# EAGLE board Main 4000 Model (EAGLE 7.4.0)
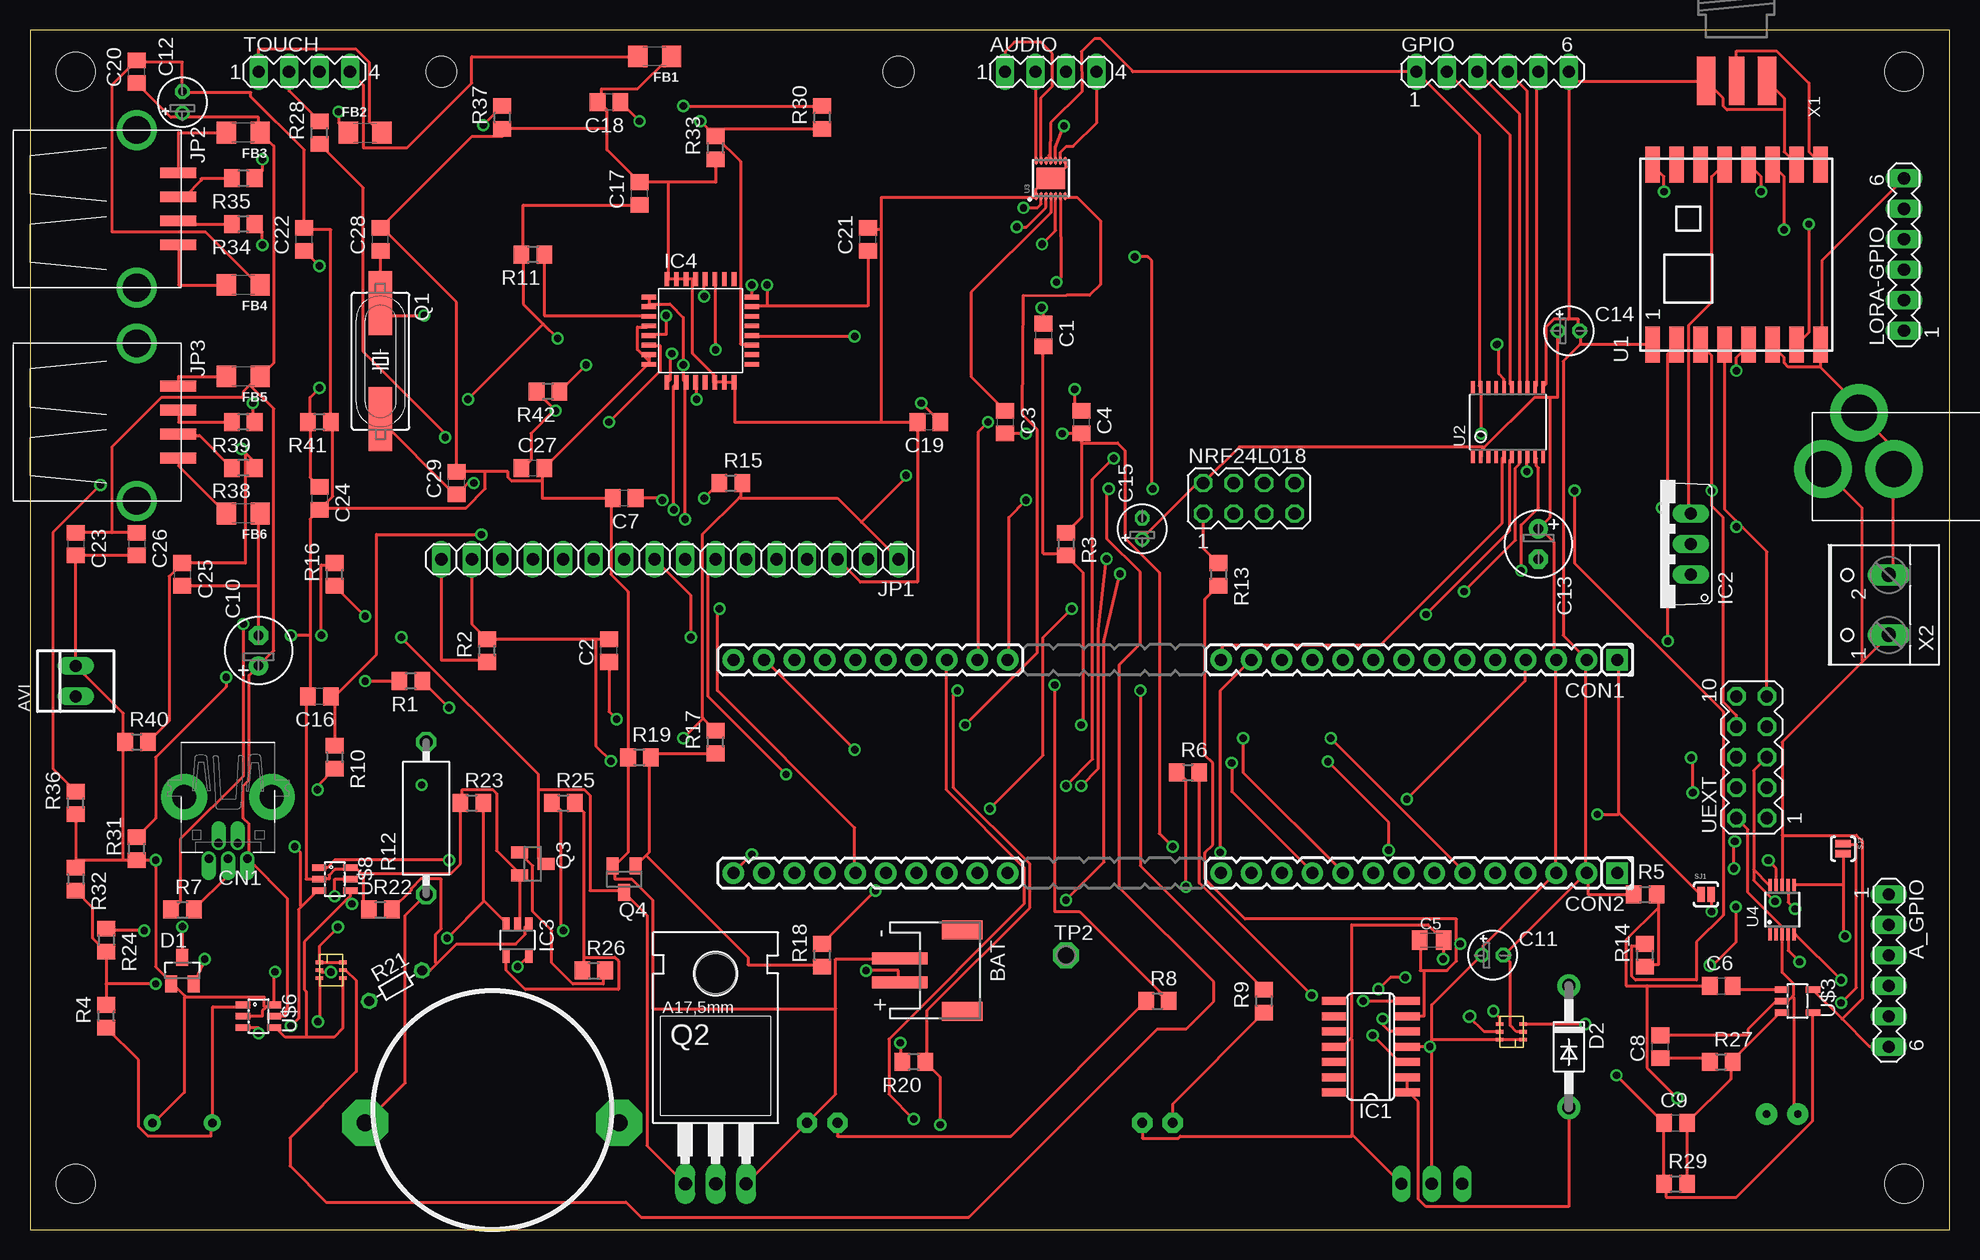
[diagram p4: board, top side]
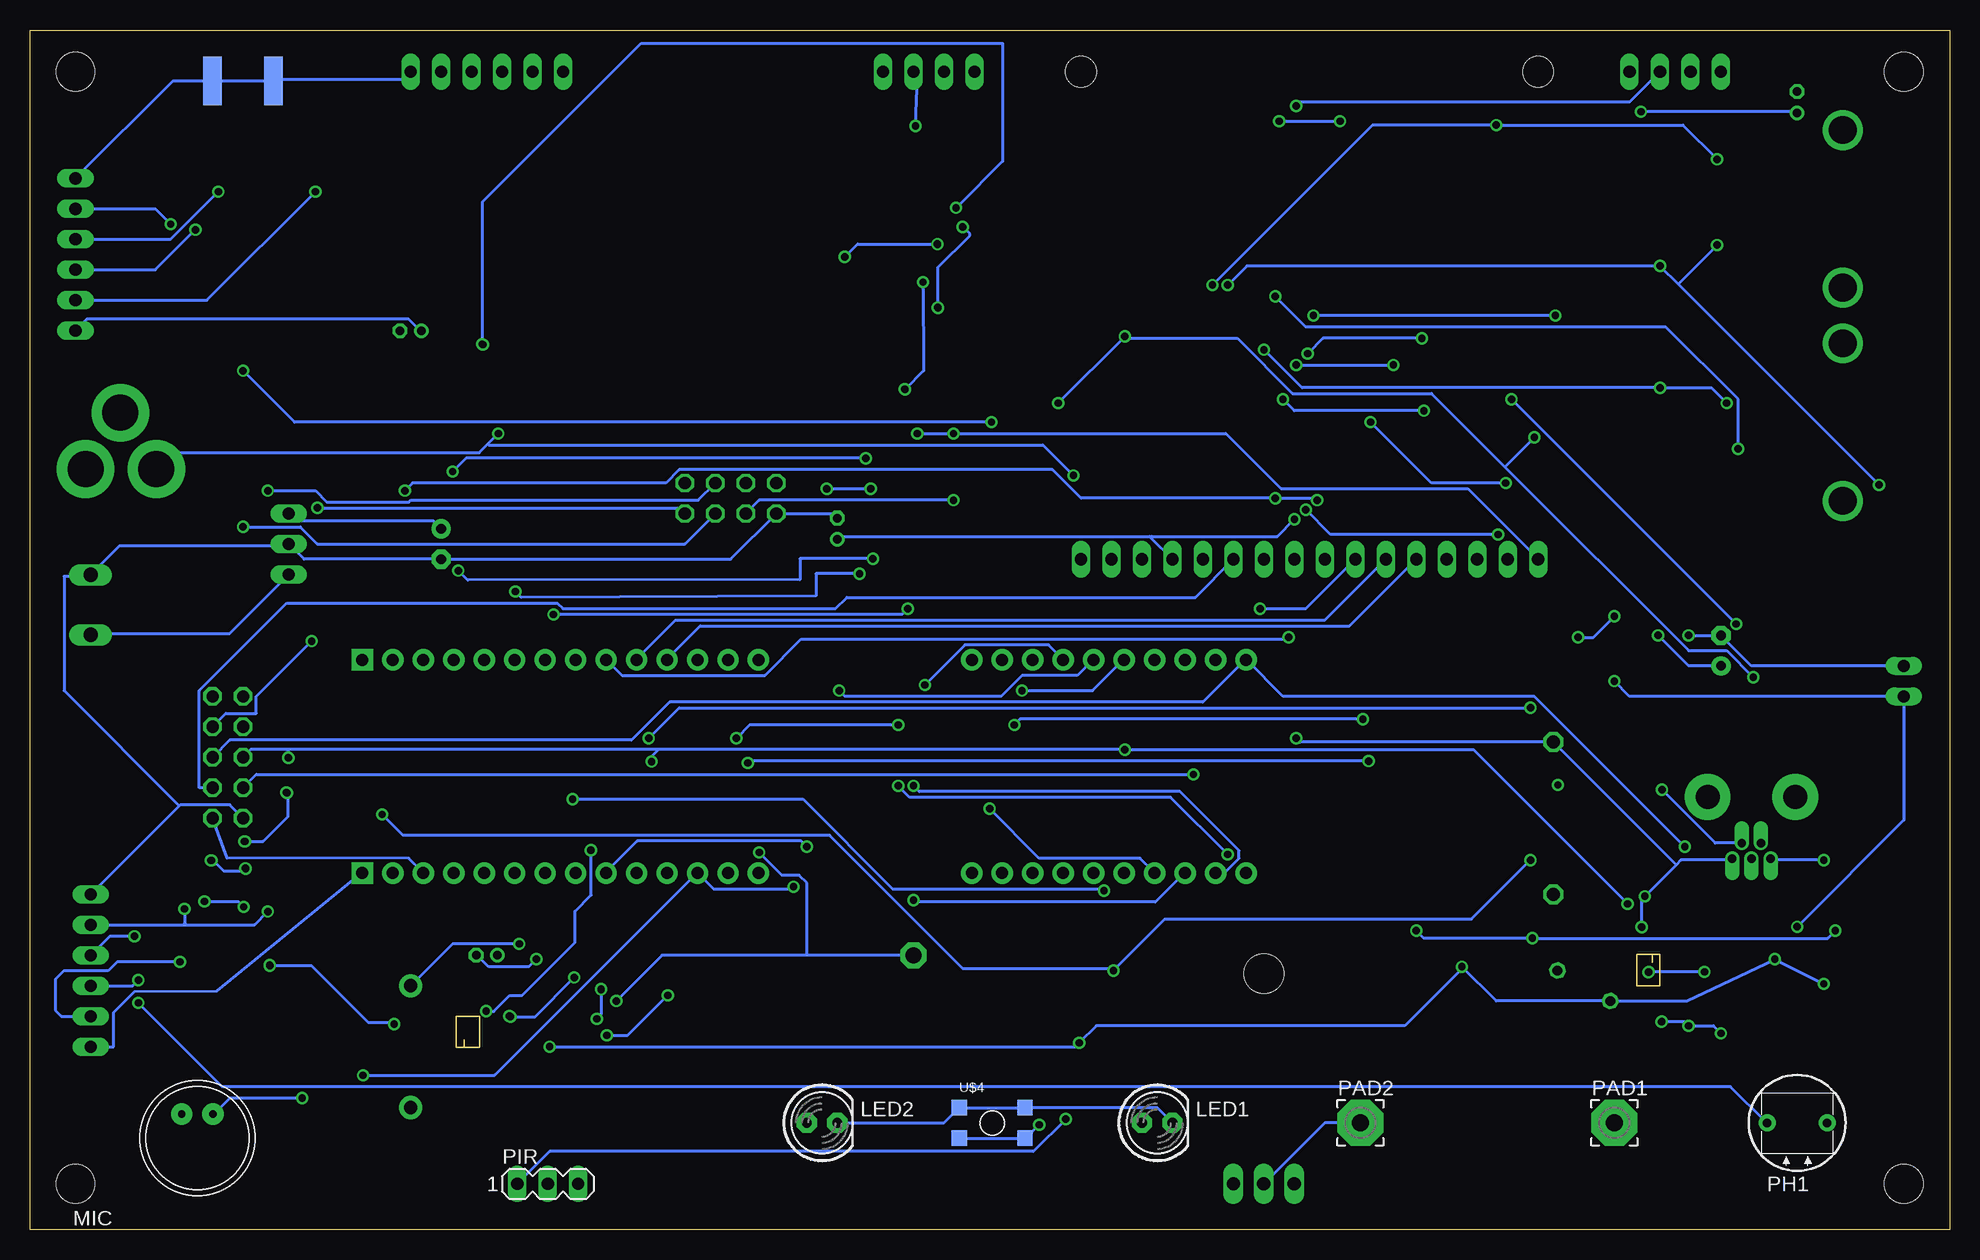
[diagram p5: board, bottom side, seen from below]

Size 160 x 100 mm. Coordinates in mm from the lower left corner, seen from the top.
Outline: 0,0 160,0 160,100 0,100 0,0
Copper layers (1*16): Top 0.035mm / dielectric 1.5mm / Bottom 0.035mm
Design rules "default": minimum track width 10mil, minimum drill 24mil, track to track 8mil, track to pad 8mil, pad to pad 8mil, via to via 8mil, smd to smd 8mil, copper to edge 40mil, drill to drill 8mil, minimum pad ring 10mil, minimum via ring 8mil, stop-mask expansion 4mil, vias tented up to drill 0mil, thermal gap 10mil
Holes 2.54 mm at 34.29,96.52 72.39,96.52
Holes 3.2 mm at 3.81,96.52 3.81,3.81 156.21,96.52 156.21,3.81

## Footprints (pad centres in the part's own frame; a part is rotated, then mirrored left to right if it is on the bottom)
MA06-1 = drill 1.016 long: 1 -6.35,0; 2 -3.81,0; 3 -1.27,0; 4 1.27,0; 5 3.81,0; 6 6.35,0
MA04-1 = drill 1.016 long: 1 -3.81,0; 2 -1.27,0; 3 1.27,0; 4 3.81,0
22-23-2021 = drill 1 long: 1 -1.27,0; 2 1.27,0
JST-PH-2-SMT-RA = smd 1 x 4.6: 1 1,-3.7; 2 -1,-3.7 | smd 1.6 x 3.4: NC1 -3.4,1.5; NC2 3.4,1.5
C0805 = smd 1.3 x 1.5: 1 -0.95,0; 2 0.95,0
C0805K = smd 1.3 x 1.6: 1 -1,0; 2 1,0
E2,5-6 = drill 0.813 pad 1.6: + -1.27,0 | drill 0.813 pad 1.6 octagon: - 1.27,0
E1,8-4 = drill 0.711 pad 1.168: + -0.889,0 | drill 0.711 pad 1.168 octagon: - 0.889,0
USB-MINIB-THM-MOLEX = drill 0.7 offset: D+ 0,9.72; D- -0.8,8.42; GND 1.6,9.72; ID 0.8,8.42; VBUS -1.6,9.72 | drill 2 pad 3.81: GND1 -3.65,4.57; GND4 3.65,4.57
HN1X30_WITHOUT(15-20) = drill 1 pad 1.778 square: 1 -36.83,0 | drill 1 pad 1.778: 2 -34.29,0; 3 -31.75,0; 4 -29.21,0; 5 -26.67,0; 6 -24.13,0; 7 -21.59,0; 8 -19.05,0; 9 -16.51,0; 10 -13.97,0; 11 -11.43,0; 12 -8.89,0; 13 -6.35,0; 14 -3.81,0; 21 13.97,0; 22 16.51,0; 23 19.05,0; 24 21.59,0; 25 24.13,0; 26 26.67,0; 27 29.21,0; 28 31.75,0; 29 34.29,0; 30 36.83,0
SOT23 = smd 1 x 1.4: 1 -0.95,-1.1; 2 0.95,-1.1; 3 0,1.1
DO41-10 = drill 1.118 pad 1.93: A 5.08,0; C -5.08,0
FB1206 = smd 1.6 x 1.8: 1 -1.4,0; 2 1.4,0
SO14 = smd 0.66 x 2.032: 1 -3.81,-3.073; 2 -2.54,-3.073; 3 -1.27,-3.073; 4 0,-3.073; 5 1.27,-3.073; 6 2.54,-3.073; 7 3.81,-3.073; 8 3.81,3.073; 9 2.54,3.073; 10 1.27,3.073; 11 0,3.073; 12 -1.27,3.073; 13 -2.54,3.073; 14 -3.81,3.073
TO220V = drill 1.016 long: 1 -2.54,-2.54; 2 0,-2.54; 3 2.54,-2.54
DBV-R-PDSO-G5 = smd 0.6 x 1.2: 1 -0.95,-1.306; 2 0,-1.306; 3 0.95,-1.306; 4 0.95,1.306; 5 -0.95,1.306
LQFP32 = smd 0.4 x 1.2: 1 -2.8,-4.3; 2 -2,-4.3; 3 -1.2,-4.3; 4 -0.4,-4.3; 5 0.4,-4.3; 6 1.2,-4.3; 7 2,-4.3; 8 2.8,-4.3; 17 2.8,4.3; 18 2,4.3; 19 1.2,4.3; 20 0.4,4.3; 21 -0.4,4.3; 22 -1.2,4.3; 23 -2,4.3; 24 -2.8,4.3 | smd 1.2 x 0.4: 9 4.3,-2.8; 10 4.3,-2; 11 4.3,-1.2; 12 4.3,-0.4; 13 4.3,0.4; 14 4.3,1.2; 15 4.3,2; 16 4.3,2.8; 25 -4.3,2.8; 26 -4.3,2; 27 -4.3,1.2; 28 -4.3,0.4; 29 -4.3,-0.4; 30 -4.3,-1.2; 31 -4.3,-2; 32 -4.3,-2.8
1X16 = drill 1.016 long: 1 -19.05,0; 2 -16.51,0; 3 -13.97,0; 4 -11.43,0; 5 -8.89,0; 6 -6.35,0; 7 -3.81,0; 8 -1.27,0; 9 1.27,0; 10 3.81,0; 11 6.35,0; 12 8.89,0; 13 11.43,0; 14 13.97,0; 15 16.51,0; 16 19.05,0
USB-A-S = smd 3 x 0.9: D+ 3.45,-1; D- 3.45,1; GND 3.45,-3; VBUS 3.45,3 | drill 2.311: P$5 0,-6.566; P$6 0,6.566
LED5MM = drill 0.813 pad 1.676 octagon: A -1.27,0; K 1.27,0
9.7ELECTRET = drill 0.6 pad 1.778: + 1.3,2; - -1.3,2
MA04-2 = drill 1.016 octagon: 1 -3.81,-1.27; 2 -3.81,1.27; 3 -1.27,-1.27; 4 -1.27,1.27; 5 1.27,-1.27; 6 1.27,1.27; 7 3.81,-1.27; 8 3.81,1.27
3,81/1,4 = drill 1.397 pad 3.81 octagon: 1 0,0
D11XX = drill 0.7 pad 1.4: 1 -2.5,0; 2 2.5,0
MA03-1 = drill 1.016 long: 1 -2.54,0; 2 0,0; 3 2.54,0
HC49UP = smd 5.334 x 1.93: 1 -4.826,0; 2 4.826,0
TO220AH = drill 1.118 long: B -2.54,-6.35; C 0,-6.35; E 2.54,-6.35 | hole 3.302: 0,11.176
R0805 = smd 1.3 x 1.5: 1 -0.95,0; 2 0.95,0
VMTB60 = drill 1.1 octagon: 1 -6.35,0; 2 6.35,0
R-5 = drill 0.813 octagon: 1 -2.54,0; 2 2.54,0
SJ_2S-NOTRACE = smd 0.635 x 1.27: 1 -0.401,0; 2 0.413,0
P1-13 = drill 1.321 pad 2.159 octagon: TP 0,0
RFM69HCW-XXXS2 = smd 3 x 1.2: 1 -7.5,7; 2 -7.5,5; 3 -7.5,3; 4 -7.5,1; 5 -7.5,-1; 6 -7.5,-3; 7 -7.5,-5; 8 -7.5,-7; 9 7.5,-7; 10 7.5,-5; 11 7.5,-3; 12 7.5,-1; 13 7.5,1; 14 7.5,3; 15 7.5,5; 16 7.5,7
TSSOP20 = smd 0.305 x 0.991: 1 -2.925,-2.918; 2 -2.275,-2.918; 3 -1.625,-2.918; 4 -0.975,-2.918; 5 -0.325,-2.918; 6 0.325,-2.918; 7 0.975,-2.918; 8 1.625,-2.918; 9 2.275,-2.918; 10 2.925,-2.918; 11 2.925,2.918; 12 2.275,2.918; 13 1.625,2.918; 14 0.975,2.918; 15 0.325,2.918; 16 -0.325,2.918; 17 -0.975,2.918; 18 -1.625,2.918; 19 -2.275,2.918; 20 -2.925,2.918
14-TDFN = smd 0.7 x 0.25: 1 -1.475,1.2; 2 -1.475,0.8; 3 -1.475,0.4; 4 -1.475,0; 5 -1.475,-0.4; 6 -1.475,-0.8; 7 -1.475,-1.2; 8 1.475,-1.2; 9 1.475,-0.8; 10 1.475,-0.4; 11 1.475,0; 12 1.475,0.4; 13 1.475,0.8; 14 1.475,1.2 | smd 1.78 x 2.35: 15 0,0
MSOP10 = smd 0.3 x 1: 1 -1,-2.05; 2 -0.5,-2.05; 3 0,-2.05; 4 0.5,-2.05; 5 1,-2.05; 6 1,2.05; 7 0.5,2.05; 8 0,2.05; 9 -0.5,2.05; 10 -1,2.05
SC-70 = smd 0.61 x 0.305: P$1 0,1.95; P$2 0,1.3; P$3 0,0.65; P$4 1.95,0.65; P$5 1.95,1.3; P$6 1.95,1.95
PJ-102A = drill 3 pad 4.8: RING 0.1,-3.39; RING_SW -4.6,-6.29; TIP 0.1,-9.29
SOT23-5L = smd 0.55 x 1.2: 1 -0.95,-1.3; 2 0,-1.3; 3 0.95,-1.3; 4 0.95,1.3; 5 -0.95,1.3
7914G = smd 1.27 x 1.27: 1 0,0; 2 0,5.486; 3 2.54,0; 4 2.54,5.486
SOT23-6 = smd 0.55 x 1.2: 1 -0.95,-1.3; 2 0,-1.3; 3 0.95,-1.3; 4 0.95,1.3; 5 0,1.3; 6 -0.95,1.3
MA05-2 = drill 1.016 octagon: 1 -5.08,-1.27; 2 -5.08,1.27; 3 -2.54,-1.27; 4 -2.54,1.27; 5 0,-1.27; 6 0,1.27; 7 2.54,-1.27; 8 2.54,1.27; 9 5.08,-1.27; 10 5.08,1.27
SMA_EDGELAUNCH = smd 4.064 x 1.524: GND@1 2.032,-2.54; GND@2 2.032,2.54 | smd 4.064 x 1.524 bottom: GND@3 2.032,2.54; GND@4 2.032,-2.54 | smd 4.064 x 1.27: P 2.032,0
W237-102 = drill 1.194 long: 1 -2.5,-1.27; 2 2.5,-1.27

## Placement (x,y rotation side)
A_GPIO  [MA06-1]  154.94,21.59 270 top
AUDIO  [MA04-1]  85.09,96.52 0 top
AVI  22-23-2021  [22-23-2021]  3.81,45.72 90 top
BAT  [JST-PH-2-SMT-RA]  76.2,21.59 270 top
C1  1uF  [C0805]  84.48,74.57 270 top
C2  1uF  [C0805]  48.26,48.26 90 top
C3  1uF  [C0805]  81.28,67.31 270 top
C4  1uF  [C0805]  87.63,67.31 270 top
C5  [C0805K]  116.84,24.13 0 top
C6  0.1uF  [C0805]  140.97,20.32 0 top
C7  0.1uF  [C0805]  49.53,60.96 180 top
C8  0.1uF  [C0805]  135.89,15.24 90 top
C9  100pf  [C0805]  137.16,8.89 0 top
C10  [E2,5-6]  19.05,48.26 90 top
C11  [E1,8-4]  121.92,22.86 0 top
C12  [E1,8-4]  12.7,93.98 90 top
C13  [E2,5-6]  125.73,57.15 270 top
C14  [E1,8-4]  128.27,74.93 0 top
C15  [E1,8-4]  92.71,58.42 90 top
C16  [C0805]  24.13,44.45 180 top
C17  [C0805]  50.8,86.36 90 top
C18  [C0805]  48.26,93.98 180 top
C19  [C0805]  74.93,67.31 180 top
C20  100uF  [C0805]  8.89,96.52 90 top
C21  [C0805]  69.85,82.55 90 top
C22  [C0805]  22.86,82.55 90 top
C23  100uF  [C0805]  3.81,57.15 270 top
C24  [C0805]  24.13,60.96 270 top
C25  [C0805]  12.7,54.61 270 top
C26  100uF  [C0805]  8.89,57.15 270 top
C27  2.2uF  [C0805]  41.91,63.5 0 top
C28  [C0805]  29.21,82.55 90 top
C29  [C0805]  35.56,62.23 90 top
CN1  [USB-MINIB-THM-MOLEX]  16.51,40.64 180 top
CON1  HN1X30_WITHOUT(15-20)  [HN1X30_WITHOUT(15-20)]  95.47,47.49 180 top
CON2  HN1X30_WITHOUT(15-20)  [HN1X30_WITHOUT(15-20)]  95.47,29.71 180 top
D1  BAT54S  [SOT23]  12.7,21.59 0 top
D2  1N4004  [DO41-10]  128.27,15.24 270 top
FB1  [FB1206]  52.07,97.79 180 top
FB2  [FB1206]  27.94,91.44 0 top
FB3  [FB1206]  17.78,91.44 180 top
FB4  [FB1206]  17.78,78.74 180 top
FB5  [FB1206]  17.78,71.12 180 top
FB6  [FB1206]  17.78,59.69 180 top
GPIO  [MA06-1]  121.92,96.52 0 top
IC1  QUAD_OPAMPD  [SO14]  111.76,15.24 90 top
IC2  7818TV  [TO220V]  135.89,57.15 90 top
IC3  TL331  [DBV-R-PDSO-G5]  40.64,24.13 180 top
IC4  TUSB2036  [LQFP32]  55.88,74.93 0 top
JP1  [1X16]  53.34,55.88 180 top
JP2  USB-A-S  [USB-A-S]  8.89,85.09 0 top
JP3  USB-A-S  [USB-A-S]  8.89,67.31 0 top
LED1  [LED5MM]  66.04,8.89 0 bottom
LED2  [LED5MM]  93.98,8.89 0 bottom
LORA-GPIO  [MA06-1]  156.21,81.28 90 top
MIC  [9.7ELECTRET]  146.05,7.62 0 bottom
NRF24L01  [MA04-2]  101.6,60.96 0 top
PAD1  [3,81/1,4]  27.94,8.89 0 bottom
PAD2  [3,81/1,4]  49.11,8.89 0 bottom
PH1  D1160_12  [D11XX]  12.7,8.89 0 bottom
PIR  [MA03-1]  116.84,3.81 0 bottom
Q1  16MHZ  [HC49UP]  29.21,72.39 270 top
Q2  TIP120  [TO220AH]  57.15,10.16 0 top
Q3  BC846  [SOT23]  41.91,30.48 270 top
Q4  BC846  [SOT23]  49.53,29.21 180 top
R1  0R  [R0805]  31.75,45.72 180 top
R2  120R  [R0805]  38.1,48.26 90 top
R3  120R  [R0805]  86.36,57.15 270 top
R4  [R0805]  6.35,17.78 90 top
R5  1M  [R0805]  134.62,27.94 0 top
R6  [R0805]  96.52,38.1 0 top
R7  [R0805]  12.7,26.67 0 top
R8  [R0805]  93.98,19.05 0 top
R9  [R0805]  102.87,19.05 90 top
R10  [R0805]  25.4,39.37 270 top
R11  1.5k  [R0805]  41.91,81.28 180 top
R12  1.8R 1.8W  [VMTB60]  33.02,34.29 90 top
R13  [R0805]  99.06,54.61 270 top
R14  2k  [R0805]  134.62,22.86 90 top
R15  2k  [R0805]  58.42,62.23 0 top
R16  3.2k  [R0805]  25.4,54.61 90 top
R17  33.2k  [R0805]  57.15,40.64 90 top
R18  2.21k  [R0805]  66.04,22.86 90 top
R19  dnp  [R0805]  50.8,39.37 0 top
R20  [R0805]  73.66,13.97 180 top
R21  THERMISTOR-5  [R-5]  30.48,20.32 30 top
R22  4.75k  [R0805]  29.21,26.67 0 top
R23  4.75k  [R0805]  36.83,35.56 0 top
R24  4.75k  [R0805]  6.35,24.13 270 top
R25  332k  [R0805]  44.45,35.56 0 top
R26  2.21k  [R0805]  46.99,21.59 0 top
R27  10k  [R0805]  140.97,13.97 0 top
R28  [R0805]  24.13,91.44 90 top
R29  100k  [R0805]  137.16,3.81 0 top
R30  [R0805]  66.04,92.71 90 top
R31  15k  [R0805]  8.89,31.75 90 top
R32  10K  [R0805]  3.81,29.21 270 top
R33  15k  [R0805]  57.15,90.17 90 top
R34  [R0805]  17.78,83.82 180 top
R35  [R0805]  17.78,87.63 180 top
R36  15k  [R0805]  3.81,35.56 90 top
R37  15k  [R0805]  39.37,92.71 90 top
R38  [R0805]  17.78,63.5 180 top
R39  [R0805]  17.78,67.31 180 top
R40  15k  [R0805]  8.89,40.64 0 top
R41  15k  [R0805]  24.13,67.31 180 top
R42  100k  [R0805]  43.18,69.85 180 top
SJ1  SOLDERJUMPER-OLDNC2  [SJ_2S-NOTRACE]  139.7,27.94 0 top
SJ2  SOLDERJUMPER-OLDNC2  [SJ_2S-NOTRACE]  151.13,31.75 270 top
TOUCH  [MA04-1]  22.86,96.52 0 top
TP2  PTR1PAD1-13  [P1-13]  86.36,22.86 0 top
U1  RFM69HCW  [RFM69HCW-XXXS2]  142.24,81.28 90 top
U2  [TSSOP20]  123.19,67.31 0 top
U3  MAX98306ETD+  [14-TDFN]  85.09,87.63 90 top
U4  ADS1015  [MSOP10]  146.05,26.67 0 top
U$1  TPL0401A/B  [SC-70]  24.13,20.32 0 top
U$2  2.1MMJACKTHM  [PJ-102A]  158.75,63.5 270 top
U$3  MAX4466  [SOT23-5L]  147.32,19.05 270 top
U$4  TACTILE-SWITCH-7914G  [7914G]  82.55,10.16 270 bottom
U$5  TPL0401A/B  [SC-70]  124.46,17.78 180 top
U$6  MCP3425SOT  [SOT23-6]  19.05,17.78 270 top
U$8  MCP3425SOT  [SOT23-6]  25.4,29.21 270 top
UEXT  [MA05-2]  143.51,39.37 90 top
X1  [SMA_EDGELAUNCH]  142.24,97.79 270 top
X2  [W237-102]  153.67,52.07 90 top

## Tracks (layer width: path | path; a pad name or v marks a point on that pad's centre or on a via)
3.3V  (via drill 0.61)
  Top 0.254: R24.2 6.35,20.48 | 6.35,20.48 R4.2 | R24.2 5.24,24.29 5.24,26.83 R32.2 | R24.2 | v40.64,21.91 41.43,22.7 IC3.5 | v14.57,22.54 13.65,20.48 D1.2 | v72.55,15.56 72.55,14.13 R20.2 | v10.48,20.48 6.35,20.48 | 51.59,77.15 51.59,77.63 IC4.25 | 51.59,77.15 51.59,76.99 IC4.26 | 51.59,77.15 53.34,77.15 54.45,76.04 v54.45,72.07 54.45,70.8 54.61,70.64 IC4.3 54.61,70.48 v54.61,59.21 | v46.35,72.07 R42.1 | C15.+ 92.71,57.63 97.31,62.23 NRF24L01.2 100.81,65.25 121.13,65.25 121.21,65.17 | 116.84,15.24 v116.68,15.24 IC1.4 | PIR.2 116.84,15.24 | 116.84,15.24 116.84,15.83 | 116.84,15.83 116.84,18.73 120.97,22.86 C11.+ 121.13,22.86 121.13,23.65 127.16,29.69 CON2.3 127.16,29.84 127.16,47.47 CON1.3 127.16,47.62 127,47.78 127,57.31 125.89,58.42 C13.+ 126.68,59.37 126.68,69.37 | IC2.3 138.27,59.85 138.27,75.41 140.18,77.31 140.18,87.79 141.13,88.74 U1.13 | 121.21,65.17 125.41,69.37 126.68,69.37 | 121.21,65.17 120.97,64.93 120.97,64.45 U2.2 | 126.68,69.37 127.32,69.37 127.32,74.93 C14.+ | 116.84,15.83 U$5.P$6 U$5.P$1
  Bottom 0.254: v10.48,20.48 v14.57,22.54 21.91,19.05 R21.1 37.78,19.05 v40.64,21.91 40.64,21.75 45.4,16.99 71.12,16.99 v72.55,15.56 72.87,15.24 v116.68,15.24 | v54.45,72.07 v46.35,72.07 | 66.6,57.71 66.67,57.78 92.55,57.78 92.71,57.63 C15.+ | 66.6,57.71 JP1.4 | v54.61,59.21 56.04,57.78 66.52,57.78 66.6,57.71 | UEXT.1 143.57,30.96 128.43,30.96 127.32,29.84 CON2.3 | LORA-GPIO.1 155.26,75.88 128.43,75.88 127.48,74.93 C14.+ | IC2.3 137.79,59.05 126.36,59.05 C13.+
5V  (via drill 0.6, 0.61)
  Top 0.254: 12.7,92.71 11.75,92.71 C20.1 | 12.7,92.71 C12.+ 12.7,93.03 | v25.72,93.19 25.72,92.23 26.51,91.44 FB2.1 | 6.83,58.1 C26.1 | 6.83,58.1 C23.1 | FB5.1 19.21,71.12 20.32,72.23 20.32,90.33 19.21,91.44 FB3.1 19.05,91.44 19.05,92.71 12.7,92.71 | 6.83,58.1 6.83,65.25 10.95,69.37 17.78,69.37 17.78,69.85 19.05,71.12 FB5.1 | 56.12,42.62 56.04,42.7 56.04,57.94 59.13,61.04 | 56.12,42.62 R17.2 | 59.13,61.04 59.21,61.12 59.21,62.23 R15.2 | 69.29,58.98 67.31,60.96 59.21,60.96 59.13,61.04 | 69.29,58.98 JP1.1 | v24.29,49.53 24.29,55.4 25.4,55.4 R16.2 | U$6.5 21.27,17.78 21.27,18.26 21.43,18.41 21.43,27.62 18.26,30.8 CN1.VBUS 18.26,30.96 18.26,33.81 17.78,34.29 17.78,36.99 18.26,37.47 18.26,46.2 C10.+ 20.32,48.26 20.32,68.42 18.41,70.33 FB5.1 | U$8.5 25.4,29.21 v25.4,27.78 | v54.45,40.96 56.12,42.62 | 84.93,89.53 84.93,89.38 84.77,89.22 U3.12 U3.11 85.03,89.16 85.08,92.26 87.69,94.86 87.64,98.19 88.74,99.29 89.21,99.29 91.92,96.59 91.92,96.52 GPIO.1 120.81,91.28 120.81,70.33 U2.19 120.97,70.17 v120.97,66.36 | 151.05,17.54 153.35,15.24 A_GPIO.6 | 151.05,17.54 148.75,19.84 U$3.5 | 146.05,32.86 146.05,40.64 152.8,47.39 | 146.05,32.86 U4.8 | 152.8,47.39 154.94,49.53 X2.1 | U$2.TIP 149.54,63.34 152.72,60.17 152.72,47.47 152.8,47.39 | 151.05,17.54 152.72,19.21 152.72,32.38 152.24,32.86 146.05,32.86 | 69.29,58.98 73.03,62.71 v73.03,62.87 | U$1.P$6 U$1.P$1 24.13,23.64 25.52,25.04 25.52,25.07 v25.65,25.2
  Bottom 0.254: v25.72,93.19 12.7,93.19 C12.+ | v24.29,49.53 21.75,46.99 C10.+ | 22.78,30.4 22.38,30.8 18.26,30.8 CN1.VBUS | 22.78,30.4 v25.4,27.78 25.65,27.53 v25.65,25.2 | 22.78,30.4 R12.2 54.13,40.64 v54.45,40.96 | A_GPIO.6 153.03,15.24 153.03,18.1 151.29,19.84 144.4,19.88 132.4,29.69 CON2.1 | IC2.1 143.35,49.69 154.94,49.69 X2.1 | 121.84,65.48 122.56,64.77 148.11,64.77 149.38,63.5 U$2.TIP | 121.84,65.48 v120.97,66.36 | v73.03,62.87 75.56,65.41 121.76,65.41 121.84,65.48
AMP
  Top 0.254: U2.5 122.71,64.29 122.71,58.9 112.55,48.74 99.38,48.74 99.38,47.62 CON1.14
AMP_PWR  (via drill 0.6)
  Top 0.254: U2.16 122.86,70.89 122.42,71.34 122.42,73.59 v122.25,73.76 | v82.8,85.17 83.97,85.17 84.29,85.49 U3.2
  Bottom 0.254: v122.25,73.76 122.25,85.7 109.06,98.9 78.92,98.9 78.92,89.05 82.66,85.31 | 82.66,85.31 | 82.66,85.31 v82.8,85.17
AUDIO_GND  (via drill 0.61)
  Top 0.254: JP1.16 34.29,47.47 38.1,47.47 R2.1 | C4.2 87.63,65.56 | 87.63,65.56 87.63,59.37 R3.1 | v83.03,66.36 C3.2 | C4.2 v86.04,66.36 | C4.2 | v95.25,31.91 94.14,33.02 94.14,54.77 91.28,57.63 91.28,64.93 90.65,65.56 87.63,65.56
  Bottom 0.254: v86.04,66.36 v83.03,66.36 60.33,66.36 55.72,61.75 40.16,61.75 JP1.16 | v95.25,31.91 95.73,32.38 109.38,32.38 111.92,29.84 CON2.9
AUDIO_L  (via drill 0.61)
  Top 0.254: v101.12,40.96 101.12,38.1 109.38,29.84 CON2.10 | v87.63,42.07 87.79,42.23 87.79,54.77 R3.2 86.36,56.36 84.45,56.36 84.45,73.11 C1.2
  Bottom 0.254: v101.12,40.96 100.01,42.07 v87.63,42.07
AUDIO_R  (via drill 0.61)
  Top 0.254: R2.2 36.83,50.48 JP1.15 | R2.2 47.15,49.21 | 47.15,49.21 C2.2 | R2.2 | v100.17,38.89 100.17,36.51 106.84,29.84 CON2.11 | v48.42,39.05 47.15,40.32 47.15,49.21
  Bottom 0.254: v100.17,38.89 100.01,39.05 v48.42,39.05
DM1  (via drill 0.61)
  Top 0.254: R33.2 59.21,89.06 59.21,73.82 60.17,73.82 IC4.11 | v50.8,92.39 C18.1 | R33.2 v55.88,92.39 | R33.2 56.67,91.76 R30.1
  Bottom 0.254: v55.88,92.39 v50.8,92.39
DM2  (via drill 0.61)
  Top 0.254: 61.44,76.99 69.85,76.99 C21.1 | 61.44,76.99 60.33,76.99 IC4.15 | v19.37,89.22 19.37,88.27 R35.1 | v37.78,92.08 R37.2 | v61.44,78.74 61.44,76.99
  Bottom 0.254: v19.37,89.22 22.23,92.08 v37.78,92.08 48.1,92.08 v61.44,78.74
DM3  (via drill 0.61)
  Top 0.254: v57.15,73.34 57.15,79.22 IC4.19 | v24.13,70.17 23.34,69.37 23.34,67.31 | 23.34,67.31 23.34,62.71 C24.1 | 23.34,67.31 R41.2 | v18.57,68.9 18.57,67.31 R39.1
  Bottom 0.254: v57.15,73.34 53.98,70.17 v24.13,70.17 19.84,70.17 v18.57,68.9
DP1  (via drill 0.61)
  Top 0.254: v68.74,74.45 60.33,74.45 IC4.12 | v74.3,68.9 75.72,67.47 75.72,67.31 C19.1 | v16.35,46.04 16.35,45.24 10.48,39.37 10.48,34.29 R31.2 | v34.61,66.04 34.61,66.36 27.78,73.18 27.78,86.84 R28.1
  Bottom 0.254: v74.3,68.9 v68.74,74.45 68.74,74.3 59.37,74.3 54.77,69.69 43.18,69.69 37.07,63.58 | v16.35,46.04 18.57,48.26 21.75,48.26 37.07,63.58 | 37.07,63.58 v34.61,66.04
DP2  (via drill 0.61)
  Top 0.254: v60.17,78.74 60.17,77.79 IC4.16 | v24.13,80.33 C22.1 | v5.87,62.07 1.91,58.1 1.91,38.42 R36.2 | v19.37,82.07 19.37,83.19 R34.1
  Bottom 0.254: v60.17,78.74 58.58,80.33 v24.13,80.33 22.62,78.82 | 22.62,78.82 v5.87,62.07 | 22.62,78.82 v19.37,82.07
DP3  (via drill 0.61)
  Top 0.254: C25.1 11.59,54.45 11.59,42.39 R40.2 | v56.2,77.79 56.2,79.22 IC4.20 | 18.02,64.69 18.57,64.14 18.57,63.5 R38.1 | 18.02,64.69 v17.62,65.09 | C25.1 17.94,55.56 17.94,64.61 18.02,64.69 | C25.1
  Bottom 0.254: v56.2,77.79 53.66,75.25 23.65,75.25 17.62,69.22 v17.62,65.09
GND  (via drill 0.6, 0.61)
  Top 0.254: R5.1 129.86,27.94 129.86,29.69 CON2.2 | CON2.2 129.7,29.69 122.87,22.86 C11.- 123.39,22.28 123.39,17.01 123.92,16.48 U$5.P$2 | CON2.2 129.7,29.84 129.7,47.47 CON1.2 129.7,47.62 127.79,49.53 127.79,72.39 129.22,73.82 | 146.21,93.34 146.21,94.3 144.78,95.73 X1.GND@3 | 146.21,93.34 146.21,89.85 147.16,88.9 U1.10 | 139.7,95.73 141.13,94.3 141.13,93.66 141.45,93.34 146.21,93.34 | 128.27,75.88 129.06,75.88 129.06,74.93 C14.- 129.22,74.93 129.22,73.82 | 128.27,75.88 127,75.88 126.36,75.25 126.36,70.48 126.21,70.33 U2.11 | 129.22,73.82 135.1,73.82 U1.1 | 128.27,95.73 128.27,75.88 | 128.27,95.73 139.7,95.73 | 139.7,95.73 X1.GND@4 | 128.27,95.73 GPIO.6 | 146.92,19.45 146.53,19.05 U$3.2 145.57,19.05 143.19,16.67 143.19,16.19 C8.2 | 146.92,19.45 147,19.53 147,20.48 146.05,21.43 U4.3 146.05,25.24 143.19,28.1 143.19,33.34 UEXT.2 | MIC.- 147.32,9.68 147,10 147,19.37 146.92,19.45 | 149.22,71.91 146.53,71.91 146.21,72.23 146.21,72.71 145.26,73.66 U1.6 | 149.22,71.91 149.22,73.66 U1.8 149.38,73.82 149.38,80.8 LORA-GPIO.6 | 149.22,71.91 152.4,68.74 152.4,68.1 U$2.RING_SW 152.56,67.94 155.26,65.25 155.26,63.5 U$2.RING 155.26,63.34 155.26,54.93 154.94,54.61 X2.2 | NRF24L01.1 97.79,56.83 R13.1 | R37.1 39.37,91.12 36.83,91.12 C28.2 29.37,83.5 35.56,77.31 C29.2 | 55.24,79.22 55.4,79.22 IC4.21 | 55.24,79.22 54.77,79.22 IC4.22 54.61,79.22 53.98,79.22 IC4.23 53.82,79.22 53.18,79.22 IC4.24 53.18,79.38 53.18,87.31 | 53.18,87.31 57.15,87.31 R33.1 | 53.18,87.31 C17.2 | 48.1,91.76 48.1,90.01 C17.2 | 48.1,91.76 48.1,93.34 47.47,93.98 C18.2 47.62,93.98 47.62,95.09 50.64,95.09 53.34,97.79 FB1.1
  Top 0.254: C17.2 | 48.1,91.76 R37.1 | R37.1 | U3.8 86.36,89.06 86.36,88.58 85.41,87.63 U3.15 84.77,87.63 83.82,86.68 83.82,86.2 U3.1 83.82,86.04 70.96,86.04 70.96,83.34 | 70.96,67.31 58.74,67.31 58.74,70.48 IC4.8 58.58,70.64 57.94,70.64 IC4.7 57.78,70.64 57.15,70.64 IC4.6 56.99,70.64 56.99,71.28 55.24,73.03 55.24,79.22 | 70.96,67.31 C19.2 | 70.96,83.34 69.85,83.34 C21.2 | 70.96,67.31 70.96,83.34 | JP1.3 69.22,53.98 73.98,53.98 C19.2 | C19.2 | 117.79,24.13 116.52,25.4 110.17,25.4 110.17,16.03 110.09,15.95 | 110.09,15.95 109.38,15.24 IC1.11 | 110.25,7.86 110.17,7.94 110.17,15.88 110.09,15.95 | 110.25,7.86 PIR.3 | Q2.E LED1.K 67.15,11.27 67.15,18.41 | 67.15,18.41 67.15,22.54 72.39,22.54 BAT.2 | LED2.K 92.71,7.62 95.73,7.62 95.89,7.78 110.17,7.78 110.25,7.86 | U$6.2 19.37,17.78 19.37,18.26 19.61,18.49 | 19.61,18.49 19.68,18.57 20.32,18.57 U$6.6 20.35,21.32 20.46,21.43 20.46,21.45 v20.42,21.48 | 12.94,19.45 13.02,19.37 19.53,19.37 19.53,18.57 19.61,18.49 | 12.94,19.45 11.91,20.48 D1.1 11.75,20.64 10.48,21.91 v10.48,30.8 R31.1 | PH1.2 10.32,8.89 12.86,11.43 12.86,19.37 12.94,19.45 | 19.05,53.66 C25.2 | C10.- 19.05,53.66 | 19.05,53.66 19.05,59.69 FB6.1 | C23.2 C26.2 | R36.1 3.81,30.8 | 3.81,30.8 7.78,30.8 | 7.78,30.8 R31.1 | 3.81,30.8 R32.1 | 7.78,30.8 7.78,40.48 R40.1 7.78,40.64 7.78,43.02 AVI.2 C23.2 | R31.1 | C23.2 | R19.1 49.85,31.43 48.74,30.32 Q4.2 48.74,30.16 48.74,29.21 50.16,29.21 51.91,27.46 51.91,18.41 67.15,18.41 | 51.59,72.39 51.59,72.87 IC4.31 | 51.59,72.39 51.59,72.23 IC4.32 51.44,72.07 C27.2 42.7,63.5 42.7,62.39 | 51.59,72.39 50.64,73.34 50.64,75.25 51.44,75.25 IC4.28 | 37.94,63.18 39.85,63.18 39.85,62.71 40.16,62.39 42.7,62.39
  Top 0.254: 37.94,63.18 C29.2 | 48.42,60.96 42.7,60.96 42.7,62.39 | 48.42,60.96 C7.2 | R19.1 49.85,53.18 48.42,54.61 48.42,60.96 | R19.1 | FB4.1 19.05,78.74 14.61,83.19 6.83,83.19 6.83,95.41 C20.2 8.89,97.31 12.7,97.31 C12.- 12.7,94.77 18.41,94.77 18.41,94.46 22.86,90.01 C22.2 22.86,83.34 25.08,83.34 R41.1 | IC3.2 40.64,25.56 40.8,25.72 40.8,29.53 Q3.2 40.8,29.69 38.89,31.59 38.89,36.35 38.58,36.67 36.04,36.67 36.04,35.56 R23.1 35.88,30.48 35.08,29.69 27.78,29.69 27.7,29.61 | 27.7,29.61 27.3,30 26.83,30 U$8.6 26.67,30 25.4,30 24.92,29.53 24.92,29.21 U$8.2 23.02,29.21 23.02,44.29 C16.2 23.34,44.45 23.34,49.53 | 27.7,29.61 27.78,29.53 27.78,27.15 R22.1 | 23.34,49.53 23.34,59.21 C24.2 | R41.1 25.24,67.15 25.24,61.12 C24.2 | C24.2 24.45,60.17 36.35,60.17 37.94,61.75 37.94,63.18 | R41.1 | 23.34,49.53 v21.75,49.53 | C29.2 | 117.79,24.13 v117.79,22.54 | 117.79,24.13 C5.2 | v25.09,21.43 24.32,21.43 U$1.P$2
  Bottom 0.254: LORA-GPIO.6 148.11,95.73 144.78,95.73 | GPIO.6 128.91,95.89 139.7,95.89 X1.GND@4 139.7,95.73 144.78,95.73 | 144.78,95.73 X1.GND@3 | 147.56,35.32 147.48,35.4 143.35,35.4 UEXT.2 | 147.56,35.32 A_GPIO.1 | C15.- 92.71,59.37 93.03,59.69 NRF24L01.1 101.6,55.88 C13.- 137.16,55.88 IC2.2 138.43,56.99 152.56,56.99 154.94,54.61 X2.2 154.94,54.45 157.16,54.45 157.16,44.93 147.56,35.32 | LED2.K 83.82,8.89 U$4.1 U$4.2 66.04,10.16 LED1.K | v10.48,30.8 14.76,30.8 CN1.GND | AVI.2 16.51,46.99 C10.- v21.75,49.53 | v117.79,22.54 118.43,21.91 121.76,21.91 122.71,22.86 C11.- | v20.42,21.48 25.04,21.48 v25.09,21.43
H_LED  (via drill 0.61)
  Top 0.254: v70.48,28.26 R18.2 | v114.78,35.88 124.62,45.72 124.62,47.47 CON1.4
  Bottom 0.254: v70.48,28.26 70.64,28.42 88.11,28.42 95.57,35.88 v114.78,35.88
LORA_CS  (via drill 0.61)
  Top 0.254: v142.24,71.6 142.24,72.71 143.19,73.66 U1.5 | v79.85,67.31 79.06,66.52 79.06,47.62 CON1.22
  Bottom 0.254: v142.24,71.6 137.95,67.31 v79.85,67.31
MIC  (via drill 0.61)
  Top 0.254: v96.36,28.57 96.36,37.47 95.73,38.1 R6.1 | U$3.4 148.59,18.1 148.59,9.05 142.24,2.7 136.37,2.7 136.37,3.81 R29.1 C9.1 | C9.1 v132.24,12.86 | C9.1
  Bottom 0.254: v96.36,28.57 96.52,28.42 103.03,28.42 104.3,29.69 CON2.12 104.46,29.69 121.28,12.86 v132.24,12.86
MISO  (via drill 0.61)
  Top 0.254: v136.53,49.05 136.53,60.17 | 136.53,60.17 136.53,73.03 137.16,73.66 U1.2 | 136.53,60.17 v136.05,60.17
  Bottom 0.254: v136.53,49.05 141.13,44.45 141.13,43.02 143.67,43.02 UEXT.7 | NRF24L01.7 105.89,60.17 v136.05,60.17
MOSI  (via drill 0.61)
  Top 0.254: UEXT.8 142.24,42.86 141.13,43.97 141.13,59.37 140.18,60.33 v140.18,61.59 140.18,72.87 139.38,73.66 U1.3
  Bottom 0.254: NRF24L01.6 104.3,60.8 128.27,60.8 128.43,60.64 135.25,60.64 136.21,61.59 v140.18,61.59
N$1  (via drill 0.61)
  Top 0.254: v148.27,83.82 148.27,74.77 147.32,73.82 U1.7
  Bottom 0.254: v148.27,83.82 149.54,85.09 LORA-GPIO.5
N$2
  Top 0.254: X1.P 142.24,98.27 145.57,98.27 148.27,95.57 148.27,89.85 149.22,88.9 U1.9
N$3  (via drill 0.61)
  Top 0.254: v144.3,86.52 144.3,87.79 143.35,88.74 U1.12
  Bottom 0.254: v144.3,86.52 148.27,82.55 LORA-GPIO.4
N$4  (via drill 0.61)
  Top 0.254: v146.21,83.34 146.21,87.79 145.26,88.74 U1.11
  Bottom 0.254: v146.21,83.34 149.54,80.01 LORA-GPIO.3
N$5  (via drill 0.61)
  Top 0.254: v136.21,86.52 136.21,87.79 135.25,88.74 U1.16
  Bottom 0.254: v136.21,86.52 145.26,77.47 LORA-GPIO.2
N$6  (via drill 0.61)
  Top 0.254: 118.9,23.81 118.9,22.38 118.11,21.59 116.2,21.59 | 118.9,23.81 118.9,25.88 101.28,25.88 97.95,29.21 97.95,31.43 98.58,32.07 98.58,38.89 97.95,39.53 97.95,52.55 R13.2 | 116.2,21.59 115.89,21.59 115.89,24.13 C5.1 | IC1.6 116.2,17.78 116.2,21.59 | 118.9,23.81 v119.22,23.81
  Bottom 0.254: D2.C 124.78,23.81 v119.22,23.81
N$9  (via drill 0.61)
  Top 0.254: 135.73,26.83 135.73,27.78 R5.2 | 135.73,26.83 135.73,22.07 134.62,22.07 R14.1 | 134.78,20.32 133.03,20.32 133.03,24.13 135.73,26.83 | 134.78,20.32 C6.1 | v137.32,10.95 134.78,13.49 134.78,20.32
  Bottom 0.254: v137.32,10.95 143.35,10.95 144.62,9.68 MIC.+
N$10  (via drill 0.6)
  Top 0.254: U$5.P$5 121.22,16.48 v119.95,17.74 | v114.63,21 113.4,21 v112.4,20 | v112.77,17.55 112.77,17.06 113.25,16.58 114.76,16.58 IC1.5
  Bottom 0.254: v119.95,17.74 117.89,17.74 v114.63,21 | v112.4,20 112.4,17.92 v112.77,17.55
N$11  (via drill 0.61)
  Top 0.254: v54.45,93.66 R30.2
  Bottom 0.254: v54.45,93.66 54.13,93.98 26.67,93.98 TOUCH.3
N$12
  Top 0.254: R35.2 14.29,87.63 14.29,87.47 13.02,86.2 12.38,86.2 JP2.D-
N$13  (via drill 0.6)
  Top 0.254: C1.1 84.48,76.64 v84.32,76.8 | v82.23,83.57 83.06,83.57 84.68,85.19 84.68,86.15 U3.3
  Bottom 0.254: v84.32,76.8 84.32,80.22 81.67,82.87 81.67,83 v82.23,83.57
N$14  (via drill 0.61)
  Top 0.254: v12.7,25.24 D1.3 | v27.94,45.72 R1.2
  Bottom 0.254: v12.7,25.24 3.81,34.13 AVI.1 26.67,44.45 v27.94,45.72
N$15
  Top 0.254: LED2.A 95.25,10.48 R9.1
N$16  (via drill 0.61)
  Top 0.254: v124.3,54.93 124.3,58.74 125.73,60.17 125.73,63.5 125.57,63.66 125.57,64.29 U2.9 | v89.74,55.92 89.06,50.01 89.06,38.42 v87.63,36.99 | v60.17,31.27 58.74,29.84 CON2.30
  Bottom 0.254: v124.3,54.93 123.51,54.13 95.82,54.17 95.82,55.92 v89.74,55.92 | v87.63,36.99 86.68,36.04 64.93,36.04 v60.17,31.27
N$17  (via drill 0.61)
  Top 0.254: v124.78,63.18 124.78,64.29 U2.8 | v90.33,64.29 88.58,62.55 88.58,39.21 v86.36,36.99
  Bottom 0.254: v124.78,63.18 123.67,64.29 v90.33,64.29 | v86.36,36.99 85.88,36.51 64.14,36.51 59.21,31.59 59.21,30.96 60.33,29.84 61.12,29.84 CON2.29
N$18  (via drill 0.61)
  Top 0.254: v119.54,53.18 123.83,57.47 123.83,63.5 124.14,63.82 124.14,64.29 U2.7 | v90.86,54.67 89.53,49.05 89.53,30.64 v86.36,27.46
  Bottom 0.254: v119.54,53.18 119.06,52.7 94.48,52.82 94.48,54.67 v90.86,54.67 | v86.36,27.46 86.2,27.3 66.2,27.3 63.82,29.69 CON2.28
N$19  (via drill 0.61)
  Top 0.254: v116.36,51.28 123.35,58.26 123.35,64.14 123.51,64.29 U2.6 | v86.84,51.75 84.45,49.37 84.45,39.53 v80.01,35.08
  Bottom 0.254: v116.36,51.28 87.31,51.28 v86.84,51.75 | v80.01,35.08 75.88,30.96 67.47,30.96 66.36,29.84 CON2.27
N$24  (via drill 0.61)
  Top 0.254: v77.95,42.07 83.98,48.1 83.98,66.67 82.71,67.94 82.8,77.87 86.38,77.88 86.4,77.89 88.33,77.89 89.22,78.79 89.22,84.1 87.28,86.04 86.36,86.04 U3.7 | v48.9,42.55 48.26,43.18 C2.1
  Bottom 0.254: v77.95,42.07 77.47,42.55 v48.9,42.55
N$25
  Top 0.254: U3.4 85.09,84.78 78.44,78.13 78.44,71.1 C3.1
N$26  (via drill 0.6)
  Top 0.254: U3.6 85.93,79.35 v85.56,78.97 | v87.07,70.03 87.07,68.82 C4.1
  Bottom 0.254: v85.56,78.97 85.52,71.59 v87.07,70.03
N$27  (via drill 0.6)
  Top 0.254: U4.4 146.55,23.26 v147.5,22.31
  Bottom 0.254: v147.5,22.31 152.75,22.31 153.49,21.57 157.18,21.57 157.88,20.87 157.88,18.29 157.38,17.78 A_GPIO.5
N$28  (via drill 0.61)
  Top 0.254: v150.97,20.8 147.16,24.61 U4.5
  Bottom 0.254: v150.97,20.8 151.45,20.32 A_GPIO.4
N$29  (via drill 0.61)
  Top 0.254: 151.13,28.73 147.16,28.73 U4.6 | SJ2.2 151.13,28.73 | v151.29,24.45 151.13,24.61 151.13,28.73
  Bottom 0.254: A_GPIO.3 153.35,24.45 v151.29,24.45
N$30  (via drill 0.6, 0.61)
  Top 0.254: v140.18,26.51 140.18,27.94 SJ1.2 | U4.7 146.55,27.27 v147.1,26.72
  Bottom 0.254: v140.18,26.51 141.29,25.4 146.96,25.4 | A_GPIO.2 146.96,25.4 | v147.1,26.72 147.1,25.55 146.96,25.4
N$31  (via drill 0.61)
  Top 0.254: v23.97,36.67 23.97,36.99 R10.2
  Bottom 0.254: v23.97,36.67 19.53,32.23 17.46,32.23 CN1.D-
N$34  (via drill 0.6)
  other vias: 32.65,37.06
N$35  (via drill 0.61)
  Top 0.254: v106.84,19.53 97.47,28.89 R6.2 | v111.92,16.19 114.14,13.97 IC1.3
  Bottom 0.254: v106.84,19.53 110.17,16.19 v111.92,16.19
N$38
  Top 0.254: IC1.2 114.78,12.7 114.78,11.43 IC1.1 114.94,11.43 115.73,10.64 115.73,2.54 116.36,1.91 128.27,1.91 D2.A
N$39
  Top 0.254: AUDIO.4 88.9,92.24 86.96,90.3 86.39,90.3 85.89,89.8 U3.9
N$40  (via drill 0.6)
  Top 0.254: U3.10 85.49,90.23 v86.18,92
  Bottom 0.254: v86.18,92 86,96.16 AUDIO.3
N$41
  Top 0.254: AUDIO.2 83.82,89.22 U3.14
N$42
  Top 0.254: U3.13 84.29,94.37 85.22,95.31 85.22,98.02 84.26,98.98 82.06,98.98 81.28,98.2 AUDIO.1
N$43
  Top 0.254: LED1.A 67.31,7.78 81.76,7.78 R8.1
N$44  (via drill 0.61)
  Top 0.254: v85.41,45.4 85.41,26.51 87.47,26.51 94.14,19.84 94.14,19.68 94.77,19.05 R8.2
  Bottom 0.254: v85.41,45.4 82.07,48.74 75.09,48.74 73.98,47.62 CON1.24
N$45  (via drill 0.61)
  Top 0.254: v92.55,44.93 92.55,30.32 R9.2
  Bottom 0.254: v92.55,44.93 92.08,44.45 79.06,44.45 77.31,46.2 72.71,46.2 71.44,47.47 CON1.25
N$46
  Top 0.254: U$3.1 145.89,20 141.92,20 C6.2
N$49  (via drill 0.61)
  Top 0.254: C7.1 52.7,60.96 v52.7,60.8 | v56.2,60.96 R15.1 | v128.75,61.59 128.75,55.56 141.13,43.18 141.13,26.19 138.91,23.97 138.91,20.8 133.83,20.8 133.51,21.11 133.51,23.65 134.62,23.65 R14.2
  Bottom 0.254: v52.7,60.8 52.86,60.96 v56.2,60.96 72.39,60.96 74.77,63.34 105.89,63.34 107,62.23 128.11,62.23 v128.75,61.59
N$50  (via drill 0.6)
  Top 0.254: U$1.P$5 26.33,21.62 27.2,20.75 27.2,13.17 21.67,7.64 21.67,5.29 24.67,2.29 49.67,2.29 50.93,1.03 78.27,1.03 93.97,16.73 96.38,16.73 98.68,19.04 98.68,20.63 90.82,28.49 90.82,47.12 92.55,48.85 92.55,54.51 92.55,54.8 89.79,57.56 89.79,61.64 v89.92,61.77 v89.92,61.78 | v93.58,61.74 93.5,61.81 93.5,80.76 93.17,81.09 v92.08,81.09 | v84.37,82.16 85.49,83.28 U3.5
  Bottom 0.254: v89.92,61.78 89.96,61.74 v93.58,61.74 | v92.08,81.09 91.01,82.16 v84.37,82.16
N$51
  Bottom 0.254: Q2.C 52.07,8.89 PAD2.1
N$52
  Top 0.254: R12.1 31.27,26.19 31.27,12.22 PAD1.1
N$53
  Top 0.254: C8.1 140.02,14.29 R27.1
N$54
  Top 0.254: 51.36,31.19 51.59,31.43 51.59,39.37 R19.2 51.75,39.69 R17.1 | 51.36,31.19 50.48,30.32 Q4.1 | 51.36,31.19 59.85,22.7 59.85,22.07 66.04,22.07 R18.1
N$56
  Top 0.254: 33.89,22.15 33.34,21.59 R21.2 | 33.89,22.15 35.56,23.81 40.48,23.81 41.27,24.61 41.27,25.24 41.43,25.4 IC3.1 | R22.2 31.75,28.26 31.75,28.42 32.54,29.21 34.29,29.21 34.29,25.08 33.81,24.61 33.81,22.23 33.89,22.15
N$58  (via drill 0.61)
  Top 0.254: 37.86,27.38 37.78,27.46 R23.2 | 37.86,27.38 39.69,25.56 IC3.3 | v9.53,24.92 6.35,24.92 R24.1 | 37.86,27.38 v34.77,24.29 | v44.45,24.92 44.29,25.08 44.29,34.92 43.66,35.56 R25.1
  Bottom 0.254: v9.53,24.92 10.16,24.29 v34.77,24.29 43.81,24.29 v44.45,24.92
N$59  (via drill 0.61)
  Top 0.254: v75.88,8.73 75.88,12.7 R20.1 74.77,13.97 74.77,18.26 83.34,26.83 83.34,30.48 76.99,36.83 76.99,44.61 v77.31,44.93
  Bottom 0.254: U$4.3 U$4.4 76.99,7.62 v75.88,8.73 | v77.31,44.93 71.44,44.93 68.9,47.47 CON1.26
N$61
  Top 0.254: 46.2,22.7 48.74,22.7 49.05,22.38 49.05,20 41.27,20 39.69,21.59 39.69,22.7 IC3.4 | 46.2,22.7 46.2,21.59 R26.1 | 46.2,22.7 46.2,34.77 R25.2
N$62
  Top 0.254: Q3.1 40.96,31.27 41.91,30.32 41.91,26.51 43.5,24.92 43.5,22.23 45.24,20.48 47.78,20.48 47.78,21.59 R26.2
N$64
  Top 0.254: GPIO.2 123.35,91.28 123.35,70.48 123.51,70.33 U2.15
N$65
  Top 0.254: GPIO.3 124.14,93.03 124.14,70.33 U2.14
N$66
  Top 0.254: GPIO.4 124.78,94.93 124.78,70.33 U2.13
N$67
  Top 0.254: GPIO.5 125.57,96.36 125.57,70.33 U2.12
N$69
  Top 0.254: C9.2 R29.2 | U$3.3 145.89,18.1 141.92,14.13 R27.2 141.76,13.97 141.76,12.54 C9.2 | C9.2
N$95  (via drill 0.6)
  other vias: 114.64,21.02
N$96  (via drill 0.6)
  other vias: 112.4,20.04
N$97  (via drill 0.6)
  other vias: 112.74,17.56
N$98  (via drill 0.6)
  other vias: 120.04,17.79
N$99  (via drill 0.6)
  other vias: 142.18,26.89
N$100  (via drill 0.6)
  other vias: 147.14,26.74
N$101  (via drill 0.6)
  other vias: 144.92,30.78
N$102
  Top 0.254: CN1.D+ 16.51,29.53 R7.2
N$103  (via drill 0.61)
  Top 0.254: v53.5,73.03 53.34,72.87 53.34,70.8 53.18,70.64 IC4.1 | 42.78,75.49 41.12,77.15 41.12,81.28 | 42.78,75.49 v43.97,74.3 | v17.78,50.48 17.78,37.78 12.54,32.54 12.54,27.3 11.91,26.67 R7.1 | 42.78,75.49 v36.51,69.22 | 41.12,81.28 41.12,85.41 C17.1 | 41.12,81.28 R11.2
  Bottom 0.254: v53.5,73.03 52.23,74.3 v43.97,74.3 | v36.51,69.22 v17.78,50.48
N$104  (via drill 0.61)
  Top 0.254: v53.66,60.01 53.66,70.33 53.82,70.48 IC4.2 | v37.62,57.94 28.89,57.94 28.89,47.94 25.24,44.29 25.08,44.29 C16.1 25.4,44.29 R10.1
  Bottom 0.254: v53.66,60.01 51.59,57.94 v37.62,57.94
N$105
  Top 0.254: IC4.27 51.44,76.2 42.86,76.2 R11.1
N$106
  Top 0.254: R34.2 12.38,83.82 12.38,83.98 JP2.D+
N$107
  Top 0.254: TOUCH.2 21.59,94.93 R28.2
N$108
  Top 0.254: TOUCH.1 19.05,98.42 27.15,98.42 28.26,97.31 28.26,92.39 29.21,91.44 FB2.2
N$109
  Top 0.254: FB1.2 36.83,97.79 36.83,95.57 31.43,90.17 27.78,90.17 27.78,95.41 TOUCH.4
N$110
  Top 0.254: FB3.2 12.38,91.44 12.38,88.11 JP2.VBUS
N$111
  Top 0.254: FB4.2 12.38,78.74 12.38,82.07 JP2.GND
N$112
  Top 0.254: R39.2 12.38,67.31 12.38,68.26 JP3.D-
N$113
  Top 0.254: R38.2 14.13,66.2 12.38,66.2 JP3.D+
N$114
  Top 0.254: FB5.2 12.38,71.12 12.38,70.33 JP3.VBUS
N$115
  Top 0.254: FB6.2 16.35,59.69 12.38,63.66 12.38,64.29 JP3.GND
N$116  (via drill 0.61)
  Top 0.254: v48.26,67.31 52.55,71.6 52.55,73.66 51.59,73.66 IC4.30 | v36.99,62.23 36.51,62.23 C29.1 35.56,61.44 35.24,61.44 29.21,67.47 Q1.2
  Bottom 0.254: v48.26,67.31 43.18,62.23 v36.99,62.23
N$117  (via drill 0.61)
  Top 0.254: v53.02,76.2 53.02,74.61 51.59,74.61 IC4.29 | v32.86,76.2 29.21,76.2 Q1.1 C28.1
  Bottom 0.254: v32.86,76.2 v53.02,76.2
N$118  (via drill 0.61)
  Top 0.254: v55.56,69.22 55.56,70.48 IC4.4 | R42.2 42.39,69.85 42.39,69.69 v43.81,68.26 43.66,68.26 41.75,66.36 41.75,64.14 41.12,63.5 C27.1
  Bottom 0.254: v55.56,69.22 54.61,68.26 v43.81,68.26
N$119  (via drill 0.6)
  other vias: 142.05,30.12
N$120  (via drill 0.6)
  other vias: 142.13,32.35
N$121  (via drill 0.6)
  other vias: 138.62,36.43
N$122  (via drill 0.6)
  other vias: 138.46,39.32
N$123  (via drill 0.6)
  other vias: 122.3,73.8
N$125  (via drill 0.6)
  other vias: 82.82,85.18
N$126  (via drill 0.6)
  other vias: 87.08,70.06
N$129  (via drill 0.6)
  other vias: 84.33,76.87
N$130  (via drill 0.6)
  other vias: 82.28,83.59
N$133  (via drill 0.6)
  other vias: 25.67,25.22
N$134  (via drill 0.6)
  other vias: 24.01,17.31
N$135  (via drill 0.6)
  other vias: 20.43,21.48
N$136  (via drill 0.6)
  other vias: 25.08,21.47
N$137  (via drill 0.6)
  other vias: 89.94,61.73
N$138  (via drill 0.6)
  other vias: 93.6,61.76
N$139  (via drill 0.6)
  other vias: 84.36,82.13
N$140  (via drill 0.6)
  other vias: 92.1,81.07
N$141  (via drill 0.6)
  other vias: 145.48,27.34
N$142  (via drill 0.6)
  other vias: 140.01,22.05
N$143  (via drill 0.6)
  other vias: 129.64,17.12
N$144  (via drill 0.6)
  other vias: 121.98,18.23
N$145  (via drill 0.6)
  other vias: 113.23,31.62
N$146  (via drill 0.6)
  other vias: 108.19,39.02
N$147  (via drill 0.6)
  other vias: 147.5,22.31
NETSTAT
  Bottom 0.254: JP1.12 50.01,50.32 104.14,50.32 106.84,47.62 CON1.11
NRF_CS  (via drill 0.61)
  Top 0.254: v83.03,60.8 81.6,59.37 81.6,47.62 CON1.21
  Bottom 0.254: NRF24L01.3 99.22,60.8 v83.03,60.8
PEAK  (via drill 0.61)
  Top 0.254: v111.12,19.05 IC1.7 | v99.22,31.43 99.22,44.93 101.76,47.47 CON1.13
  Bottom 0.254: v111.12,19.05 107.31,22.86 95.25,22.86 | TP2.TP 95.25,22.86 | v99.22,31.43 97.31,29.53 95.89,29.53 95.25,28.89 95.25,22.86
PHOTO  (via drill 0.61)
  Top 0.254: U$6.1 17.62,18.57 15.24,18.57 15.24,8.89 PH1.1 15.08,8.89 15.08,7.78 9.84,7.78 9.05,8.57 9.05,14.13 R4.1 | v150.97,18.89 152.24,20.16 152.24,32.07 151.13,32.07 SJ2.1
  Bottom 0.254: v150.97,18.89 143.99,11.91 18.26,11.91 15.24,8.89 PH1.1
PIR  (via drill 0.61)
  Top 0.254: v73.66,9.21 71.6,11.27 71.6,15.88 82.87,27.15 82.87,30.16 76.36,36.67 76.36,47.47 CON1.23
  Bottom 0.254: PIR.1 116.68,6.51 76.36,6.51 v73.66,9.21
PWRKEY  (via drill 0.61)
  Top 0.254: JP1.9 55.09,52.86 v55.09,49.37
  Bottom 0.254: v55.09,49.37 55.24,49.21 95.73,49.21 98.74,46.2 110.65,46.2 111.92,47.47 CON1.9
PWRSTAT
  Bottom 0.254: JP1.11 52.07,50.8 106.2,50.8 109.38,47.62 CON1.10
Q18  (via drill 0.61)
  Top 0.254: 42.39,36.67 46.2,36.67 46.67,36.2 46.67,28.26 49.53,28.26 Q4.3 51.44,26.19 51.44,6.99 Q2.B | 42.39,36.67 42.39,30.96 42.86,30.48 Q3.3 | v27.94,51.12 R16.1 | v30.96,49.37 42.39,37.94 42.39,36.67
  Bottom 0.254: v27.94,51.12 29.69,49.37 v30.96,49.37
RI  (via drill 0.61)
  Top 0.254: v57.47,51.75 57.31,51.59 57.31,44.93 68.74,33.5 68.74,29.84 CON2.26
  Bottom 0.254: JP1.10 53.66,51.75 v57.47,51.75
RX  (via drill 0.61)
  Top 0.254: JP1.7 56.52,55.24 56.52,44.45 v63.02,37.94
  Bottom 0.254: v63.02,37.94 141.13,37.94 UEXT.4
SCK  (via drill 0.61)
  Top 0.254: 142.48,58.82 144.78,56.52 UEXT.9 | 142.48,58.82 141.29,60.01 141.29,73.66 U1.4 | 142.48,58.82 v142.24,58.58
  Bottom 0.254: NRF24L01.5 105.41,57.15 136.05,57.15 137.48,58.58 v142.24,58.58
SCL  (via drill 0.6, 0.61)
  Top 0.254: 143.67,30 144.94,28.73 U4.10 | 143.67,30 143.67,38.26 UEXT.5 | v19.05,16.35 19.05,16.83 17.78,16.83 U$6.3 | v21.75,16.99 22.38,17.62 22.38,26.67 22.62,26.91 | 22.62,26.91 23.97,28.26 U$8.3 | v22.07,31.91 22.54,31.43 22.54,26.99 22.62,26.91 | U$1.P$3 24.13,17.85 24.05,17.77 24.05,17.41 v23.97,17.34 | 143.67,30 143.67,29.11 v145.44,27.34 | v142.19,26.89 142.19,23.93 140.34,22.09 140.09,22.09 v140,22 | v129.64,17.12 124.47,17.12 U$5.P$3
  Bottom 0.254: v19.05,16.35 19.68,16.99 v21.75,16.99 22.1,17.34 v23.97,17.34 | v22.07,31.91 34.61,44.45 55.56,44.45 58.58,47.47 CON1.30 58.74,47.47 62.23,43.97 106.68,43.97 109.86,40.8 143.35,40.8 UEXT.5 | v145.44,27.34 142.64,27.34 v142.19,26.89 | v140,22 136.55,22 131.82,17.28 129.8,17.28 v129.64,17.12
SDA  (via drill 0.6, 0.61)
  Top 0.254: 23.02,16.03 21.27,16.03 20.48,16.83 U$6.4 | 23.02,16.03 23.02,19.84 22.86,20 22.86,23.97 26.43,27.54 | 26.43,27.54 26.67,27.78 26.67,28.26 U$8.4 | v68.74,40.01 61.28,47.47 CON1.29 | v26.83,27.15 26.43,27.54 | U4.9 145.55,30.08 v144.87,30.76 | v142.02,30.08 142.02,32.3 v142.08,32.36 | v138.58,36.38 138.58,39.23 v138.47,39.34 | U$1.P$4 26.08,16.78 25.34,16.04 23.02,16.04 23.02,16.03 | U$5.P$4 122.51,17.65 v121.98,18.18 | v113.27,31.62 113.27,33.93 v108.19,39.01
  Bottom 0.254: UEXT.6 141.6,40.01 138.44,40.01 | 107.61,40.01 v68.74,40.01 39.69,40.01 v26.83,27.15 | 107.61,40.01 138.44,40.01 | v144.87,30.76 144.72,30.76 143.85,29.89 142.22,29.89 v142.02,30.08 | v142.08,32.36 140.57,32.36 138.5,34.44 138.5,36.29 v138.58,36.38 | v138.47,39.34 138.47,39.98 138.44,40.01 | v121.98,18.18 121.34,18.18 120.01,19.51 118.98,19.51 114.57,23.92 114.57,26.53 113.21,27.89 113.21,31.56 v113.27,31.62 | v108.19,39.01 108.19,39.43 107.61,40.01
TX
  Bottom 0.254: JP1.6 62.87,52.7 91.92,52.7 92.87,51.75 115.57,51.75 116.05,52.23 138.59,52.23 145.89,44.93 145.89,36.83 UEXT.3
VBAT  (via drill 0.61)
  Top 0.254: 132.48,34.69 132.4,34.77 132.4,47.47 CON1.1 | 132.48,34.69 139.22,27.94 SJ1.1 | v34.92,30.8 25.4,30.8 24.77,30.16 24.13,30.16 U$8.1 | v69.69,21.59 72.39,21.59 72.39,20.64 BAT.1 | v130.65,34.61 132.4,34.61 132.48,34.69
  Bottom 0.254: v34.92,30.8 39.85,25.88 65.41,25.88 v69.69,21.59 69.69,21.75 82.23,21.75 93.34,32.86 128.91,32.86 v130.65,34.61
VDAC  (via drill 0.61)
  Top 0.254: v34.92,43.5 R1.1 | v108.43,40.96 119.54,29.84 CON2.6
  Bottom 0.254: v34.92,43.5 105.89,43.5 v108.43,40.96